# EAGLE schematic question_1 (EAGLE 8.2.2)
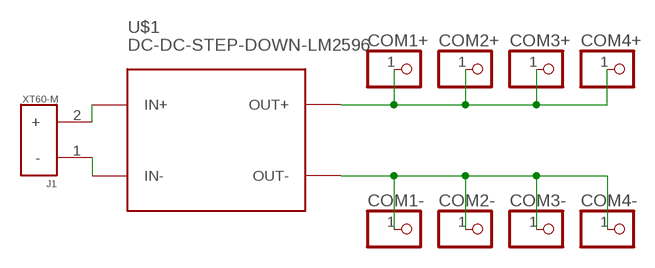
[diagram p0: schematic, sheet 1]

## Parts
COM1+  PINHD-1X1  [1X01]
COM1-  PINHD-1X1  [1X01]
COM2+  PINHD-1X1  [1X01]
COM2-  PINHD-1X1  [1X01]
COM3+  PINHD-1X1  [1X01]
COM3-  PINHD-1X1  [1X01]
COM4+  PINHD-1X1  [1X01]
COM4-  PINHD-1X1  [1X01]
J1  XT60-M  [AMASS_XT60-M]
U$1  DC-DC-STEP-DOWN-LM2596  [DC-DC-STEP-DOWN-LM2596]

## Nets
N$1: J1.1(-) U$1.IN-
N$2: J1.2(+) U$1.IN+
N$3: COM1+.1 COM2+.1 COM3+.1 COM4+.1 U$1.OUT+
N$4: COM1-.1 COM2-.1 COM3-.1 COM4-.1 U$1.OUT-

## Library data of the parts
COM1+ COM1- COM2+ COM2- COM3+ COM3- COM4+ COM4- = adafruit:PINHD-1X1: Pin header 1x1 for 0.1" spacing With round pins
J1 = XT60-M:XT60-M: DC supply; XT60; male; PIN:2; for cable; soldered; 60A; 500V; AVAILABILITY: Unavailable; DESCRIPTION: Plug; DC supply; XT60; male; PIN: 2; for cable; soldered; 30A; 500V; MF: AMASS; MP: XT60-M; PACKAGE: Package; PRICE: None
U$1 = lm2596:DC-DC-STEP-DOWN-LM2596: DC/DC Step-Down Regulator based on LM2596-ADJ chip LM2596 datasheet available here: http://www.ti.com/lit/ds/symlink/lm2596.pdf Click here to find device on ebay.com <http://www.ebay.com/sch/lm2596+power+regulator>